# Altium schematic sheet MAIN.SchDoc: MAIN
size 558 x 431 mm; Date: 02/07/2022; CheckedBy: RTZ, HYW; Author: RTZ, HYW; CompanyName: Upenn; DrawnBy: RTZ, HYW; Engineer: RTZ, HYW; Organization: Upenn ESE; Address1: Electrical Engineering; Address2: 200 South 33rd St; Address3: Philadelphia; Address4: PA, 19104; SheetNumber: 1; SheetTotal: 11; ENG_APP_DATE: 02/15/22; DSN_APP_DATE: 02/15/22; CHK_APP_DATE: 02/15/22; DOC_NO_ASSY_DWG: TBD; DOC_NO_FAB_DWG: TBD; PCB_DWG_NO: TBD; Project: SimonSayGame; DESIGN_ITEM: 1.0; CAGE_CODE: TBD; DOC_NO_SCH_DWG: TBD; SCH_SCALE: NA; Time: 13:18
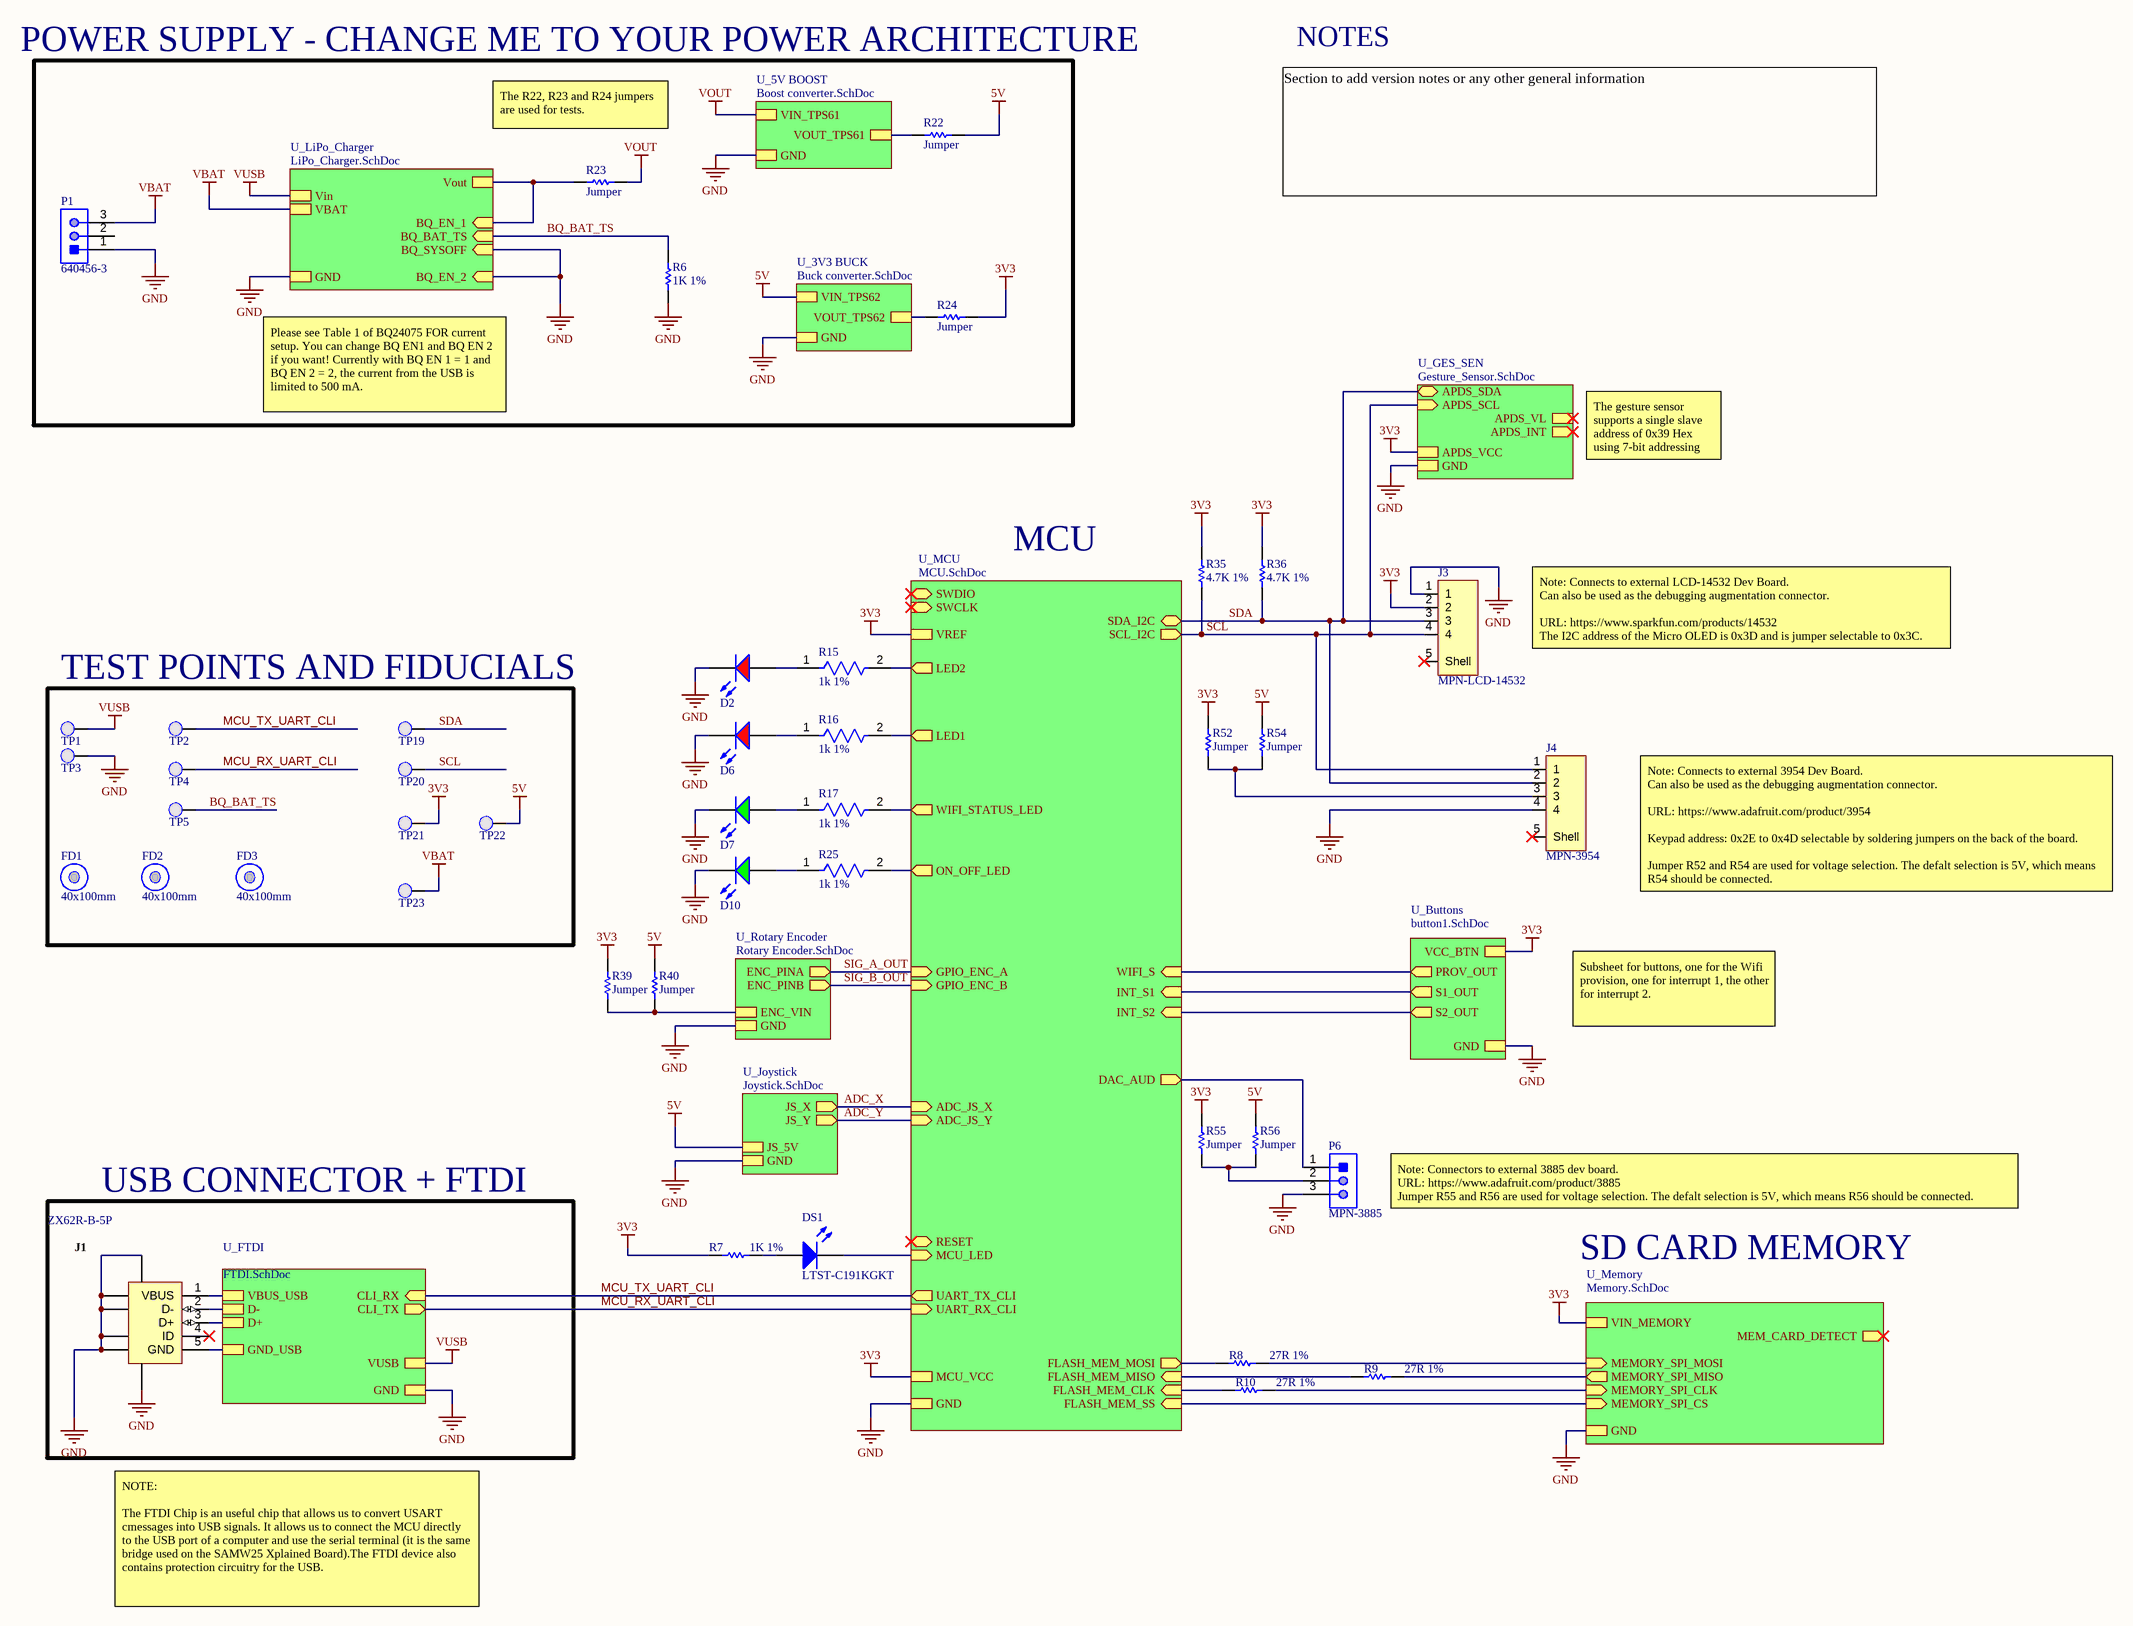
[diagram p0: MAIN.SchDoc]

## Parts
D2  LTST-C170CKT  [LTST-C170CKT_V]  (value not drawn)
D6  LTST-C170CKT  [LTST-C170CKT_V]  (value not drawn)
D7  LTST-C170GKT  [LTST-C170GKT_V]  (value not drawn)
D10  LTST-C170GKT  [LTST-C170GKT_V]  (value not drawn)
DS1  LTST-C191KGKT  [LITE-ON-LTST-C191KRKT-2_V]
FD1  40x100mm  [Fiducial_FT]  (no BOM)
FD2  40x100mm  [Fiducial_FT]  (no BOM)
FD3  40x100mm  [Fiducial_FT]  (no BOM)
J1  ZX62R-B-5P  [HIRO-ZX62R-B-5P_V]
J3  MPN-LCD-14532  [S4B-PH-SM4-TB(LF)(SN)]
J4  MPN-3954  [S4B-PH-SM4-TB(LF)(SN)]
P1  640456-3  [TECO-640456-3]
P6  MPN-3885  [JST-S3B-PH-SM4-TB-3_V]
R6  1K 1%  [RESC0603(1608)_N]
R7  1K 1%  [RESC0603(1608)_N]
R8  27R 1%  [RESC0603(1608)_N]
R9  27R 1%  [RESC0603(1608)_N]
R10  27R 1%  [RESC0603(1608)_N]
R15  1k 1%  [FP-RMCF0603-IPC_B]
R16  1k 1%  [FP-RMCF0603-IPC_B]
R17  1k 1%  [FP-RMCF0603-IPC_B]
R22  Jumper  [RESC0805(2012)_N]
R23  Jumper  [RESC0805(2012)_N]
R24  Jumper  [RESC0805(2012)_N]
R25  1k 1%  [FP-RMCF0603-IPC_B]
R35  4.7K 1%  [RESC1608X55X30NL15T15]
R36  4.7K 1%  [RESC1608X55X30NL15T15]
R39  Jumper  [RESC0603(1608)_N]
R40  Jumper  [RESC0603(1608)_N]  (no BOM)
R52  Jumper  [RESC0603(1608)_N]  (no BOM)
R54  Jumper  [RESC0603(1608)_N]
R55  Jumper  [RESC0603(1608)_N]  (no BOM)
R56  Jumper  [RESC0603(1608)_N]
TP1  0.1" Pad  [PCBComponent]  (value not drawn)  (no BOM)
TP2  0.1" Pad  [PCBComponent]  (value not drawn)  (no BOM)
TP3  0.1" Pad  [PCBComponent]  (value not drawn)  (no BOM)
TP4  0.1" Pad  [PCBComponent]  (value not drawn)  (no BOM)
TP5  0.1" Pad  [PCBComponent]  (value not drawn)  (no BOM)
TP19  0.1" Pad  [PCBComponent]  (value not drawn)  (no BOM)
TP20  0.1" Pad  [PCBComponent]  (value not drawn)  (no BOM)
TP21  0.1" Pad  [PCBComponent]  (value not drawn)  (no BOM)
TP22  0.1" Pad  [PCBComponent]  (value not drawn)  (no BOM)
TP23  0.1" Pad  [PCBComponent]  (value not drawn)  (no BOM)

## Blocks framed on the sheet
TEST POINTS AND FIDUCIALS: FD1-FD3 TP1-TP5 TP19-TP23
USB CONNECTOR + FTDI: J1

## Sub-sheets
U_3V3 BUCK = Buck converter.SchDoc: VIN_TPS62, GND, VOUT_TPS62
U_5V BOOST = Boost converter.SchDoc: VIN_TPS61, GND, VOUT_TPS61
U_Buttons = button1.SchDoc: VCC_BTN, GND, PROV_OUT (out), S1_OUT (out), S2_OUT (out)
U_FTDI = FTDI.SchDoc: CLI_RX (in), CLI_TX (out), VUSB, GND, VBUS_USB, D-, D+, GND_USB
U_GES_SEN = Gesture_Sensor.SchDoc: APDS_VL, APDS_INT (out), APDS_SDA (bidir), APDS_SCL (in), GND, APDS_VCC
U_Joystick = Joystick.SchDoc: JS_X (out), JS_Y (out), JS_5V, GND
U_LiPo_Charger = LiPo_Charger.SchDoc: BQ_EN_2 (in), BQ_SYSOFF (in), BQ_EN_1 (in), BQ_BAT_TS (in), Vin, Vout, GND, VBAT
U_MCU = MCU.SchDoc: SWDIO (bidir), SWCLK (in), UART_TX_CLI (out), UART_RX_CLI (in), FLASH_MEM_SS (in), FLASH_MEM_CLK (in), FLASH_MEM_MISO (in), FLASH_MEM_MOSI (out), RESET (bidir), MCU_LED (in), MCU_VCC, GND, GPIO_ENC_A (in), GPIO_ENC_B (in), ADC_JS_X (in), ADC_JS_Y (in), SDA_I2C (bidir), SCL_I2C (out), DAC_AUD (out), WIFI_S (in), INT_S1 (in), INT_S2 (in), LED2 (out), LED1 (out), WIFI_STATUS_LED (out), ON_OFF_LED (out), VREF
U_Memory = Memory.SchDoc: MEMORY_SPI_MOSI (in), MEMORY_SPI_MISO (out), MEMORY_SPI_CLK (in), MEMORY_SPI_CS (in), MEM_CARD_DETECT (out), VIN_MEMORY, GND
U_Rotary Encoder = Rotary Encoder.SchDoc: ENC_PINA (out), ENC_PINB (out), ENC_VIN, GND

## Nets
3V3: J3.2 R7.1 R24.2 R35.2 R36.2 R39.2 R52.2 R55.2 TP21.1(PAD) ; sheet U_MCU/MCU_VCC, sheet U_MCU/VREF, sheet U_Memory/VIN_MEMORY, sheet U_GES_SEN/APDS_VCC, sheet U_Buttons/VCC_BTN
5V: R22.2 R40.2 R54.2 R56.2 TP22.1(PAD) ; sheet U_Joystick/JS_5V, sheet U_3V3 BUCK/VIN_TPS62
GND: D2.2(K) D6.2(K) D7.2(K) D10.2(K) J1.6(SHLD) J1.7(SHLD) J1.8(SHLD) J1.9(SHLD) J1.10(SHLD) J1.11(SHLD) J3.1 J4.4 P1.1 P6.3 R6.2 TP3.1(PAD) ; sheet U_FTDI/GND, sheet U_MCU/GND, sheet U_Memory/GND, sheet U_LiPo_Charger/BQ_EN_2, sheet U_LiPo_Charger/BQ_SYSOFF, sheet U_LiPo_Charger/GND, sheet U_Rotary Encoder/GND, sheet U_Joystick/GND, sheet U_5V BOOST/GND, sheet U_3V3 BUCK/GND, sheet U_GES_SEN/GND, sheet U_Buttons/GND
VBAT: P1.3 TP23.1(PAD) ; sheet U_LiPo_Charger/VBAT
VOUT: R23.2 ; sheet U_5V BOOST/VIN_TPS61
VUSB: TP1.1(PAD) ; sheet U_FTDI/VUSB, sheet U_LiPo_Charger/Vin
ADC_X: sheet U_MCU/ADC_JS_X, sheet U_Joystick/JS_X
ADC_Y: sheet U_MCU/ADC_JS_Y, sheet U_Joystick/JS_Y
BQ_BAT_TS: R6.1 TP5.1(PAD) ; sheet U_LiPo_Charger/BQ_BAT_TS
MCU_RX_UART_CLI: TP4.1(PAD) ; sheet U_FTDI/CLI_TX, sheet U_MCU/UART_RX_CLI
MCU_TX_UART_CLI: TP2.1(PAD) ; sheet U_FTDI/CLI_RX, sheet U_MCU/UART_TX_CLI
SCL: J3.4 J4.1 R35.1 TP20.1(PAD) ; sheet U_MCU/SCL_I2C, sheet U_GES_SEN/APDS_SCL
SDA: J3.3 J4.2 R36.1 TP19.1(PAD) ; sheet U_MCU/SDA_I2C, sheet U_GES_SEN/APDS_SDA
SIG_A_OUT: sheet U_MCU/GPIO_ENC_A, sheet U_Rotary Encoder/ENC_PINA
SIG_B_OUT: sheet U_MCU/GPIO_ENC_B, sheet U_Rotary Encoder/ENC_PINB
NetD2_1: D2.1(A) R15.1
NetD6_1: D6.1(A) R16.1
NetD7_1: D7.1(A) R17.1
NetD10_1: D10.1(A) R25.1
NetDS1_1: DS1.1(A) R7.2
NetDS1_2: DS1.2(K) ; sheet U_MCU/MCU_LED
NetJ1_1: J1.1(VBUS) ; sheet U_FTDI/VBUS_USB
NetJ1_2: J1.2(D-) ; sheet U_FTDI/D-
NetJ1_3: J1.3(D+) ; sheet U_FTDI/D+
NetJ1_5: J1.5(GND) ; sheet U_FTDI/GND_USB
NetJ4_3: J4.3 R52.1 R54.1
NetP6_1: P6.1 ; sheet U_MCU/DAC_AUD
NetP6_2: P6.2 R55.1 R56.1
NetR8_1: R8.1 ; sheet U_MCU/FLASH_MEM_MOSI
NetR8_2: R8.2 ; sheet U_Memory/MEMORY_SPI_MOSI
NetR9_1: R9.1 ; sheet U_MCU/FLASH_MEM_MISO
NetR9_2: R9.2 ; sheet U_Memory/MEMORY_SPI_MISO
NetR10_1: R10.1 ; sheet U_MCU/FLASH_MEM_CLK
NetR10_2: R10.2 ; sheet U_Memory/MEMORY_SPI_CLK
NetR15_2: R15.2 ; sheet U_MCU/LED2
NetR16_2: R16.2 ; sheet U_MCU/LED1
NetR17_2: R17.2 ; sheet U_MCU/WIFI_STATUS_LED
NetR22_1: R22.1 ; sheet U_5V BOOST/VOUT_TPS61
NetR23_1: R23.1 ; sheet U_LiPo_Charger/BQ_EN_1, sheet U_LiPo_Charger/Vout
NetR24_1: R24.1 ; sheet U_3V3 BUCK/VOUT_TPS62
NetR25_2: R25.2 ; sheet U_MCU/ON_OFF_LED
NetR39_1: R39.1 R40.1 ; sheet U_Rotary Encoder/ENC_VIN
(unnamed): sheet U_MCU/FLASH_MEM_SS, sheet U_Memory/MEMORY_SPI_CS
(unnamed): sheet U_MCU/WIFI_S, sheet U_Buttons/PROV_OUT
(unnamed): sheet U_MCU/INT_S1, sheet U_Buttons/S1_OUT
(unnamed): sheet U_MCU/INT_S2, sheet U_Buttons/S2_OUT

Not connected (* = marked no-connect by the designer): J1 4(ID)*; J3 5(Shell)*; J4 5(Shell)*; P1 2

## Notes on the sheet
- NOTES
- POWER SUPPLY - CHANGE ME TO YOUR POWER ARCHITECTURE
- The R22, R23 and R24 jumpers are used for tests.
- Section to add version notes or any other general information
- Please see Table 1 of BQ24075 FOR current setup. You can change BQ EN1 and BQ EN 2 if you want! Currently with BQ EN 1 = 1 and BQ EN 2 = 2, the current from the USB is limited to 500 mA.
- The gesture sensor supports a single slave address of 0x39 Hex
  using 7-bit addressing protocol.
- MCU
- Note: Connects to external LCD-14532 Dev Board.
  Can also be used as the debugging augmentation connector.
  URL: https://www.sparkfun.com/products/14532
  The I2C address of the Micro OLED is 0x3D and is jumper selectable to 0x3C.
- Note: Connects to external 3954 Dev Board.
  Can also be used as the debugging augmentation connector.
  URL: https://www.adafruit.com/product/3954
  Keypad address: 0x2E to 0x4D selectable by soldering jumpers on the back of the board.
  Jumper R52 and R54 are used for voltage selection. The defalt selection is 5V, which means R54 should be connected.
- Subsheet for buttons, one for the Wifi provision, one for interrupt 1, the other for interrupt 2.
- Note: Connectors to external 3885 dev board.
  URL: https://www.adafruit.com/product/3885
  Jumper R55 and R56 are used for voltage selection. The defalt selection is 5V, which means R56 should be connected.
- SD CARD MEMORY
- NOTE:
  The FTDI Chip is an useful chip that allows us to convert USART cmessages into USB signals. It allows us to connect the MCU directly to the USB port of a computer and use the serial terminal (it is the same bridge used on the SAMW25 Xplained Board).The FTDI device also contains protection circuitry for the USB.
- DWG. NO.
- REV.
- SHT.
- REVISION
- DESCRIPTION
- DATE
- APPROVED
- THIS DOCUMENT AND THE DATA DISCLOSED HEREIN OR HEREWITH IS THE PROPERTY OF ALTIUM LIMITED AND MAY BE FREELY DISTRIBUTED IN WHOLE. NO RIGHTS ARE RESERVED OR EXPRESS OR IMPLIED WARANTEE GIVEN.
- ENG:
- DSN:
- APPROVALS
- PROJECT
- DOCUMENT REVISION:
- DESIGN ITEM:
- CHK:
- BOM:
- REFERENCE DOCUMENTS
- PROJECT REVISION:
- TITLE
- FAB DWG:
- PCB DWG:
- ASSY DWG:
- SCALE:
- SIZE
- C
- CAGE CODE
- FILE NAME
- DWG NO.
- SHEET
- OF
- REV

## Library data of the parts
D2 D6 = CMP-1674-00001-5: LED Uni-Color Red, 100 mW, 200 mA, -55 to 85 degC, 2-Pin SMD, RoHS, Tape and Reel; Manufacturer: Lite-On; PackageReference: C170CKT; ComponentLink1Description: Manufacturer URL; ComponentLink1URL: http://www.us.liteon.com/; Package Quantity: 3000; Packaging: Tape and Reel; Pins: 2; ComponentLink2URL: http://media.digikey.com/pdf/Data%20Sheets/Lite-On%20PDFs/LTST-C170CKT.pdf; Max Operating Temperature: 85 degC; Min Operating Temperature: -55 degC; Mounting Technology: Surface Mount; Mount: Surface Mount; Length: 2 mm; ComponentLink2Description: Datasheet; DatasheetVersion: 03/2003; Height: 1.1 mm; PackageDescription: 2-Pin Surface Mount Device, Body 2 x 1.25 mm; RoHSCompliant: true; Colour: Red
D7 D10 = CMP-1674-00002-5: LED Uni-Color Green, 100 mW, 120 mA, -55 to 85 degC, 2-Pin SMD, RoHS, Tape and Reel; Manufacturer: Lite-On; PackageReference: C170GKT; ComponentLink1Description: Manufacturer URL; ComponentLink1URL: http://www.us.liteon.com/; Height: 1.1 mm; PackageDescription: 2-Pin Surface Mount Device, Body 2 x 1.25 mm; RoHSCompliant: true; Package Quantity: 1; Packaging: Tape and Reel; Mount: Surface Mount; Min Operating Temperature: -55 degC; DatasheetVersion: 03/2003; Max Operating Temperature: 85 degC; Pins: 2; Mounting Technology: Surface Mount; Length: 2 mm; Colour: Green; ComponentLink2URL: http://media.digikey.com/pdf/Data%20Sheets/Lite-On%20PDFs/LTST-C170GKT.pdf; ComponentLink2Description: Datasheet
DS1 = CMP-2000-05198-1: Chip LED, Green, 574 nm, 40 pF, -55 to 85 degC, 2-Pin SMD, RoHS, Tape and Reel; Manufacturer: Lite-On; Rad Hardened: No; Emitting Color: YellowGreen; Product Height (mm): 0.55mm; Forward Voltage: 2.4V; Number of Elements: 1; Dominant Wave Length: 571nm; DELETED: Compliant; Viewing Angle: 130deg; High Brightness: Yes; Peak Wavelength: 574nm; Type: Uni-Color; Forward Current: 30mA; Product Length (mm): 1.6mm; Luminous Intensity: 35mcd; Test Current (It): 20mA; Chip Material: AlGaInP; Product Depth (mm): 0.8mm; Shape Type: Rectangular; Reverse Voltage: 5V; Power Dissipation: 75W; Pin Count: 2; Lens Dimensions: 1.1X0.8X0.37mm; Packaging: TapeandReel; Main Category: ChipLED; Operating Temperature Classification: Industrial; Package Type: ChipLed; Mounting: SurfaceMount; Lum Intensity: 35mcd; Operating Temp Range: -55Cto85C; Datasheet Version: Jan-07; Datasheet URL: http://download.siliconexpert.com/pdfs/2007/08/26/semi_b/manual/lot/ds/ltst-c191kgkt.pdf; Manufacturer URL: http://www.us.liteon.com/
FD1-FD3 = CMP-00174-A.4: Fiducial 40x100mm
J1 = CMP-0031-00001-1: Connector; USBMicro-B,Reverse type, SMT; 5 Position; Right Angle; DatasheetVersion: 08/2010; Operating Temperature: -30 to 85 degC; Mounting Technology: Surface Mount; PartNumber: ZX62R-B-5P; PackageReference: ZX62R-B-5P; ComponentLink2URL: http://www.hirose.co.jp/cataloge_hp/e24200011.pdf; ComponentLink1URL: http://www.hirose.com/â€Ž; ComponentLink2Description: Datasheet; PackageDescription: 5-Pin USB Micro-B R/A Connector; ComponentLink1Description: Manufacturer URL
J3 J4 = S4B-PH-SM4-TB(LF)(SN): LCD Keypad Connector-JST (JAPAN SOLDERLESS TERMINALS) - S4B-PH-SM4-TB(LF)(SN) - Wire-To-Board Connector, 2 mm, 4 Contacts, Header, PH Series, Surface Mount, 1 Rows, S4B-PH-SM4-TB(LF)(SN); Manufacturer: JST; Number of Positions: 4; Insulation Resistance: 1GR; Gender: Male; Current Rating: 2A; Voltage Rating: 100V; Connector Type: Header,Male Pin; Contact Resistance: 20mR; Pitch: 2mm; Supplier 1: Newark; Manufacturer Part Number: S4B-PH-SM4-TB(LF)(SN); RoHS: Yes; Category: Connectors; Mount: Surface Mount; Housing Material: Polyamide; Color: Natural,White; Contact Material: Copper Alloy,Tin,Bronze,Brass; Contact Plating: Tin,Copper; Housing Color: Beige; Contact Shape: Square; Insulation Material: Nylon; Insulation Color: Natural; Min Operating Temperature: -25°C; Max Operating Temperature: 85°C; Termination: Solder; Number of Contacts: 4; Number of Rows: 1; Packaging: Tape and Reel; Voltage Rating (AC): 100V; Orientation: Right Angle; Fastening Type: Detent; Working Voltage: 100V; Max Voltage Rating (AC): 100V; Max Voltage Rating (DC): 100V; Number of Poles: 4; Max Current Rating: 2A; Length: 11.9mm; Width: 5mm; Height: 9.4mm; Contact Mating Length: 0.13inch; Depth: 7.6mm; Lead Pitch: 2mm; Lead Free: Lead Free; REACH SVHC: No SVHC; Flammability Rating: UL94 V-0; ComponentLink1URL: https://datasheet.ciiva.com/11746/0900766b80df0d9d-11746552.pdf?src-supplier=RSComponents; ComponentLink1Description: https://datasheet.ciiva.com/11746/0900766b80df0d9d-11746552.pdf?src-supplier=RSComponents; ComponentLink2URL: https://datasheet.ciiva.com/712/eph-712578.pdf?src-supplier=Digi-Key; ComponentLink2Description: https://datasheet.ciiva.com/712/eph-712578.pdf?src-supplier=Digi-Key; ComponentLink3URL: https://datasheet.ciiva.com/712/eph-712579.pdf?src-supplier=Digi-Key; ComponentLink3Description: https://datasheet.ciiva.com/712/eph-712579.pdf?src-supplier=Digi-Key; ComponentLink4URL: https://datasheet.ciiva.com/730/eph-730675.pdf?src-supplier=Digi-Key; ComponentLink4Description: https://datasheet.ciiva.com/730/eph-730675.pdf?src-supplier=Digi-Key; ComponentLink5URL: https://datasheet.ciiva.com/8052/1699381-8052234.pdf?src-supplier=Element14; ComponentLink5Description: https://datasheet.ciiva.com/8052/1699381-8052234.pdf?src-supplier=Element14; ComponentLink6URL: https://datasheet.ciiva.com/26894/getdatasheetpartid-639990-26894620.pdf?src-supplier=Verical; ComponentLink6Description: https://datasheet.ciiva.com/26894/getdatasheetpartid-639990-26894620.pdf?src-supplier=Verical; ComponentLink7URL: https://datasheet.ciiva.com/16376/eph-16376783.pdf?src-supplier=Future+Electronics; ComponentLink7Description: https://datasheet.ciiva.com/16376/eph-16376783.pdf?src-supplier=Future+Electronics; Supplier Part Number 1: 38K8075
P1 = CMP-2000-05418-1: Male Header, Pitch 2.54 mm, 1 x 3 Position, Height 10.03 mm, Tail Length 3.56 mm, -55 to 105 degC; Manufacturer: TE Connectivity; Agency Approvals: CSA,UL; Angle: Straight; Number of Positions: 3; Standards: RoHSCompliant,ELVCompliant,UL94V-0; Current, Rating: 5 / A; Connector Type: MTA-100; Mount Angle: Vertical; Material, Housing: Polyester; Temperature, Operating: -55to+105 / degC; Voltage, Rating: 250 / V; Color, Housing: White; Contact Centerline Spacing: 0.100 / in.; Special Features: Pinstrip; Material, Contact: CopperAlloy; Contact Termination Area Plating: Tin; Primary Type: InterconnectSystem; Pin Spacing: 0.1 / "; Brand/Series: MTA-100Series; Mounting Hole Size: 0.04 / "; Manufacturer URL: http://www.te.com/; Datasheet URL: https://datasheet.ciiva.com/16456/eng-ds-82056-mta-0608-16456886.pdf; Flammability Rating: UL94V-0; Mounting Type: PCMount; Contact Mating Area Plating: Tin; Datasheet Version: Jun-08; Number of Rows: 1; Termination: Solder; Type: PCBPlug; Length, Pin: 0.14 / "; Color: White; Contact Plating: Tin; Contact Shape: Square; Number of Contacts: 3; Size, Post: 0.025 / in.; Length, Terminal Post: 0.14 / in.; Length, Overall: 0.3 / "
P6 = CMP-2000-07023-1: Disconnectable Crimp Style Connector, 2 A, 100 V, Right Angle, -25 to 85 degC, 3-Pin SMD, RoHS, Tape and Reel,S3B-PH-SM4-TB(LF)(SN); Manufacturer: JST; Current Rating: 2mA; No of Positions: 3; Voltage Rating: 100V; Style/Orientation: RightAngleHeader/Plug; Pitch: 2mm; No. of Rows: 1; Mounting Technology: SurfaceMount; Package Description: 3-Pin Surface Mount Device, Body 9.9 x 7.6 mm, Pitch 2 mm; Type: WiretoBoard; Datasheet URL: https://datasheet.ciiva.com/16201/jst20s3b-ph-sm4-tb-lf-sn-16201903.pdf; Manufacturer URL: http://www.jst.com/home2.html; No. of Positions: 3; PartNumber: S3B-PH-SM4-TB; Termination: Crimp; Orientation: RightAngle; Package URL: https://datasheet.ciiva.com/16201/jst20s3b-ph-sm4-tb-lf-sn-16201903.pdf; Package Reference: S3B-PH-SM4-TB-3; Datasheet Version: 12/2012
R6 R7 = CMP-1012-00510-1: 1K 0.1W 1% 0603 (1608 Metric)  SMD; Case-Metric: 1608; Case-EIA: 0603; Value: 1000.00 Ohm; Technology: SMT; Tolerance: 1 %; Power: 0.1 W
R8-R10 = CMP-1012-00331-1: 27R 0.1W 1% 0603 (1608 Metric)  SMD; Case-EIA: 0603; Value: 27.00 Ohm; Case-Metric: 1608; Technology: SMT; Tolerance: 1 %; Power: 0.1 W
R15-R17 R25 = CMP-26527-003160-1: 1kΩ ±1% 0.1W 0603 Thick Film Chip Resistor AEC-Q200 compliant; Max Power Dissipation: 100mW; Temperature Coefficient: 100ppm/°C; Resistance: 1kR; Radiation Hardening: No; Case Code (Metric): 1608; Length: 0.061inch; Series: RMCF; Resistor Type: Thick Film; Tolerance: 1%; Height: 0.022inch; Mount: Surface Mount; Number of Terminations: 2; Max Operating Temperature: 155°C; Min Operating Temperature: -55°C; Lead Free: Lead Free; Case/Package: 0603; Contact Plating: Tin; Packaging: Tape and Reel; RoHS Compliant: Yes; Width: 0.031inch; Case Code (Imperial): 0603; Features: Automotive AEC-Q200
R22-R24 = CMP-1013-00001-1: Jumper 0805 (2012 Metric); Case-EIA: 0805; Value: 0.00 Ohm; Tolerance: None; Case-Metric: 2012; Technology: SMT; Power: None
R35 R36 = CMP-1012-00586-3: Precision Thick Film Chip Resistor, 4.7 KOhm, +/- 1%, -55 to 155 degC, 0603 (1608 Metric), RoHS, Tape and Reel; Resistance: 220 Ohm; Voltage Rating: 50 V; Elements: 4; Case\Package: 1205; Tolerance: 5%; Power Rating: 250 mW; PackageReference: 0603; Max Operating Temperature: 125 degC; REACH SVHC: No SVHC; Width: 0.063 inch; Length: 0.126 inch; Height: 0.024 inch; Mount: Surface Mount; Package Quantity: 1; DatasheetVersion: Apr-15; ComponentLink1Description: Manufacturer URL; Min Operating Temperature: -55 degC; Packaging: Tape and Reel; Radiation Hardening: No; ComponentLink2URL: http://industrial.panasonic.com/cdbs/www-data/pdf/RDA0000/AOA0000C86.pdf; Case Code (Metric): 3216; Pins: 8; Case Code (Imperial): 1206; Type (Resistor): Thick Film; RoHSCompliant: true; ComponentLink2Description: Datasheet; PackageDescription: 2-Pin Surface Mount Device, Body 1.6 x 0.85 mm; ComponentLink1URL: http://www.panasonic.com/
R39 R40 R52 R54-R56 = CMP-1012-00001-1: Jumper 0603 (1608 Metric); Case-Metric: 1608; Value: 0.00 Ohm; Power: None; Case-EIA: 0603; Technology: SMT; Tolerance: None
TP1-TP5 TP19-TP23 = 0.1" Pad-A.4